# EAGLE design Final Board (EAGLE 7.2.0)
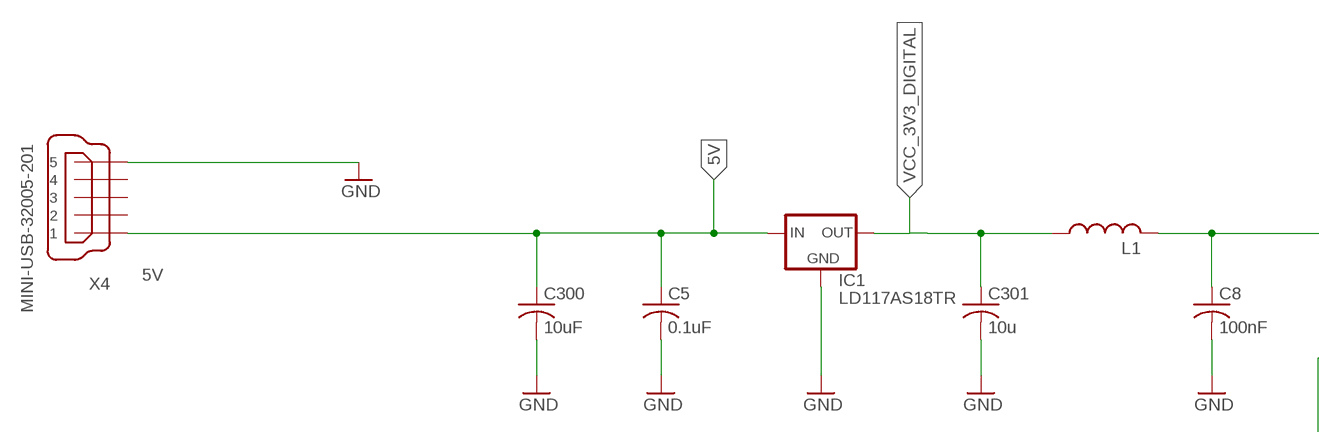
[diagram p0: schematic, sheet 1, part 1 of 2]
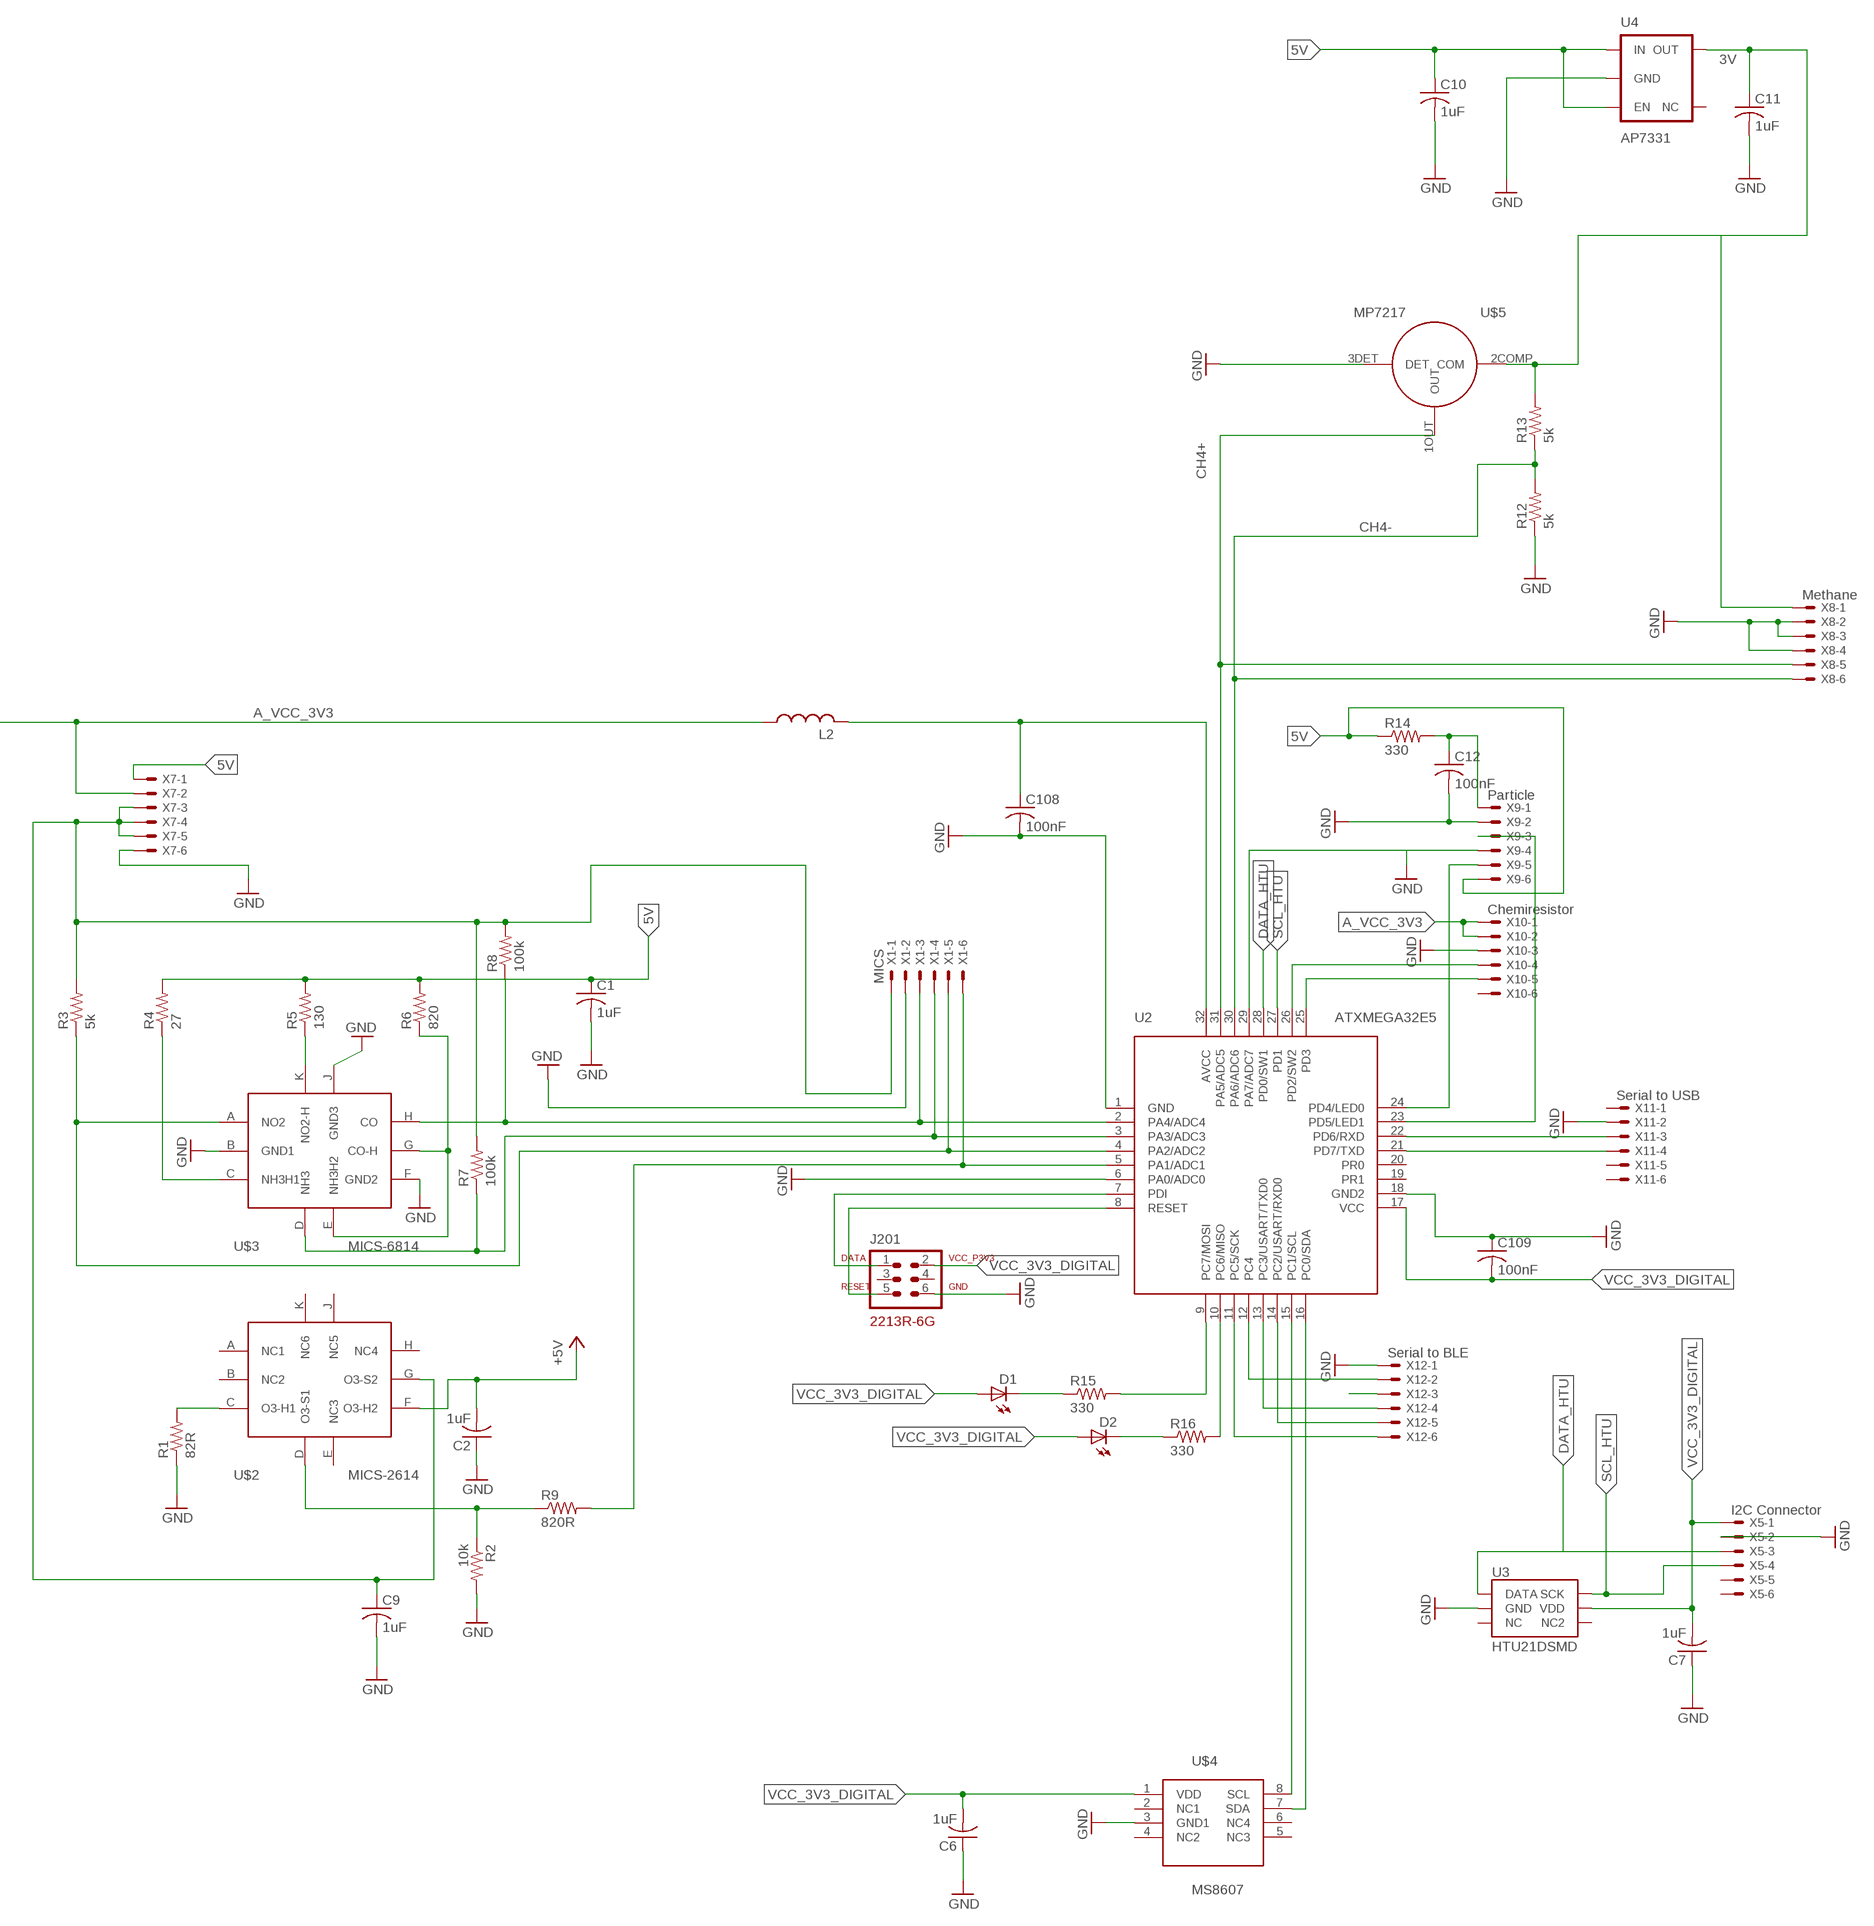
[diagram p1: schematic, sheet 1, part 2 of 2]

## Parts
C1  1uF  C-USC0805  [C0805]
C2  1uF  C-USC0805  [C0805]
C5  0.1uF  C-USC0603  [C0603]
C6  1uF  C-USC0805  [C0805]
C7  1uF  C-USC0805  [C0805]
C8  100nF  C-USC0402  [C0402]
C9  1uF  C-USC0805  [C0805]
C10  1uF  C-USC0805  [C0805]
C11  1uF  C-USC0805  [C0805]
C12  100nF  C-USC0402  [C0402]
C108  100nF  C-USC0402  [C0402]
C109  100nF  C-USC0402  [C0402]
C300  10uF  C-USC1206  [C1206]
C301  10u  C-USC1206  [C1206]
D1  LEDSML0805  [SML0805]
D2  LEDSML0805  [SML0805]
IC1  LD117AS18TR  [SOT223]
J201  PDI  AVR-ISP-6  [AVR-ISP-6]
L1  0603INDUCTOR  [R0603]
L2  0603INDUCTOR  [R0603]
R1  82R  R-US_R0805  [R0805]
R2  10k  R-US_R0805  [R0805]
R3  5k  R-US_R0805  [R0805]
R4  27  R-US_R0805  [R0805]
R5  130  R-US_R0805  [R0805]
R6  820  R-US_R0805  [R0805]
R7  100k  R-US_R0805  [R0805]
R8  100k  R-US_R0805  [R0805]
R9  820R  R-US_R0805  [R0805]
R12  5k  R-US_R0805  [R0805]
R13  5k  R-US_R0805  [R0805]
R14  330  R-US_R0402  [R0402]
R15  330  R-US_R0402  [R0402]
R16  330  R-US_R0402  [R0402]
U2  ATMEGA328P_TQFP  ATXMEGA32E5  [ATXMEGA32E5]
U3  HTU21DSMD  [HTU21D]
U4  AP2202-ADJ  AP7331  [AP7331]
U$2  MICS-2614-SMD8  [MICS-2614-SMD8]
U$3  MICS-6814-SMD8  [MICS-6814-SMD8]
U$4  PTH  [PTHSENSOR]
U$5  MP-7217  [MP-7217]
X1  MICS  22-23-2061  [22-23-2061]
X4  MINI-USB-32005-201  [32005-201]
X5  I2C Connector  22-23-2061  [22-23-2061]
X7  22-23-2061  [22-23-2061]
X8  Methane  22-23-2061  [22-23-2061]
X9  Particle  22-23-2061  [22-23-2061]
X10  Chemiresistor  22-23-2061  [22-23-2061]
X11  Serial to USB  22-23-2061  [22-23-2061]
X12  Serial to BLE  22-23-2061  [22-23-2061]

## Nets
3V: C11.1 R13.2 U4.5(OUT) U$5.2COMP(COM) X8.1
5V: C1.1 C2.2 C5.1 C10.1 C300.1 IC1.3(IN) R4.2 R5.2 R6.2 R9.2 R14.1 U2.5(PA1/ADC1) U4.1(IN) U4.3(EN) U$2.F(O3-H2) X1.6 X4.1 X7.1 X9.6 ; supply symbol labelled +5V
A_VCC_3V3: C8.1 L1.2 L2.1 X7.2 X10.1 X10.2
CH4+: U2.31(PA5/ADC5) U$5.1OUT(OUT) X8.5
CH4-: R12.2 R13.1 U2.30(PA6/ADC6) X8.6
DATA_HTU: U2.28(PD0/SW1) U3.DATA X5.3
GND: C1.2 C2.1 C5.2 C6.1 C7.1 C8.2 C9.2 C10.2 C11.2 C12.2 C108.2 C109.1 C300.2 C301.2 IC1.1(GND) J201.6(GND) R1.1 R2.2 R12.1 U2.1(GND) U2.6(PA0/ADC0) U2.18(GND2) U2.29(PA7/ADC7) U3.GND U4.2(GND) U$3.B(GND1) U$3.F(GND2) U$3.J(GND3) U$4.3(GND1) U$5.3DET(DET) X1.2 X4.5 X5.2 X7.6 X8.2 X8.3 X8.4 X9.2 X9.4 X10.3 X11.2 X12.1
IC1: R3.1 U2.4(PA2/ADC2) U$3.A(NO2) X1.5
N$1: R1.2 U$2.C(O3-H1)
N$2: J201.1(DATA) U2.7(PDI)
N$3: J201.5(RESET) U2.8(RESET)
N$4: R16.2 U2.10(PC6/MISO)
N$5: U2.25(PD3) X10.5
N$6: U2.22(PD6/RXD) X11.3
N$7: R7.1 U2.3(PA3/ADC3) U$3.D(NH3) X1.4
N$8: R6.1 U$3.E(NH3H2) U$3.G(CO-H)
N$9: R5.1 U$3.K(NO2-H)
N$10: R4.1 U$3.C(NH3H1)
N$12: R8.1 U2.2(PA4/ADC4) U$3.H(CO) X1.3
N$13: C108.1 L2.2 U2.32(AVCC)
N$14: U2.26(PD2/SW2) X10.4
N$15: U2.24(PD4/LED0) X9.5
N$16: U2.23(PD5/LED1) X9.3
N$17: U2.16(PC0/SDA) U$4.7(SDA)
N$18: U2.15(PC1/SCL) U$4.8(SCL)
N$19: U2.13(PC3/USART/TXD0) X12.4
N$20: U2.14(PC2/USART/RXD0) X12.5
N$21: R2.1 R9.1 U$2.D(O3-S1)
N$22: C12.1 R14.2 X9.1
N$23: C9.1 R3.2 R7.2 R8.2 U$2.G(O3-S2) X1.1 X7.3 X7.4 X7.5
N$24: U2.21(PD7/TXD) X11.4
N$26: D1.C R15.1
N$27: U2.12(PC4) X12.2
N$28: D2.C R16.1
N$29: R15.2 U2.9(PC7/MOSI)
N$31: U2.11(PC5/SCK) X12.6
N$32: X12.3
SCL_HTU: U2.27(PD1) U3.SCK X5.4
VCC_3V3_DIGITAL: C6.2 C7.2 C109.2 C301.1 D1.A D2.A IC1.2(OUT) J201.2(VCC_P3V3) L1.1 U2.17(VCC) U3.VDD U$4.1(VDD) X5.1
Unconnected: J201.3(NC1) J201.4(NC2) U2.19(PR1) U2.20(PR0) U3.NC@6(NC2) U4.4(NC) U$2.A(NC1) U$2.B(NC2) U$2.E(NC3) U$2.H(NC4) U$2.J(NC5) U$2.K(NC6) U$4.2(NC1) U$4.4(NC2) U$4.5(NC3) U$4.6(NC4) X4.2 X4.3 X4.4 X5.5 X5.6 X10.6 X11.1 X11.5 X11.6

## Power pins joined to a net without a drawn wire
NC: U3.NC@1(NC)

## Library data of the parts
C1 C2 C5-C12 C108 C109 C300 C301 = resistor:C-US: CAPACITOR, American symbol
D1 D2 = led:LED: LED OSRAM: - CHIPLED LG R971, LG N971, LY N971, LG Q971, LY Q971, LO R971, LY R971 LH N974, LH R974 LS Q976, LO Q976, LY Q976 LO Q996 - Hyper CHIPLED LW Q18S LB Q993, LB Q99A, LB R99A - SideLED LS A670, LO A670, LY A670, LG A670, LP A670 LB A673, LV A673, LT A673, LW A673 LH A674 LY A675 LS A676, LA A676, LO A676, LY A676, LW A676 LS A679, LY A679, LG A679 - Hyper Micro SIDELED® LS Y876, LA Y876, LO Y876, LY Y876 LT Y87S - SmartLED LW L88C, LW L88S LB L89C, LB L89S, LG L890 LS L89K, LO L89K, LY L89K LS L896, LA L896, LO L896, LY L896 - TOPLED LS T670, LO T670, LY T670, LG T670, LP T670 LSG T670, LSP T670, LSY T670, LOP T670, LYG T670 LG T671, LOG T671, LSG T671 LB T673, LV T673, LT T673, LW T673 LH T674 LS T676, LA T676, LO T676, LY T676, LB T676, LH T676, LSB T676, LW T676 LB T67C, LV T67C, LT T67C, LS T67K, LO T67K, LY T67K, LW E67C LS E67B, LA E67B, LO E67B, LY E67B, LB E67C, LV E67C, LT E67C LW T67C LS T679, LY T679, LG T679 LS T770, LO T770, LY T770, LG T770, LP T770 LB T773, LV T773, LT T773, LW T773 LH T774 LS E675, LA E675, LY E675, LS T675 LS T776, LA T776, LO T776, LY T776, LB T776 LHGB T686 LT T68C, LB T68C - Hyper Mini TOPLED® LB M676 - Mini TOPLED Santana® LG M470 LS M47K, LO M47K, LY M47K Source: http://www.osram.convergy.de LUXEON: - LUMILED® LXK2-PW12-R00, LXK2-PW12-S00, LXK2-PW14-U00, LXK2-PW14-V00 LXK2-PM12-R00, LXK2-PM12-S00, LXK2-PM14-U00 LXK2-PE12-Q00, LXK2-PE12-R00, LXK2-PE12-S00, LXK2-PE14-T00, LXK2-PE14-U00 LXK2-PB12-K00, LXK2-PB12-L00, LXK2-PB12-M00, LXK2-PB14-N00, LXK2-PB14-P00, LXK2-PB14-Q00 LXK2-PR12-L00, LXK2-PR12-M00, LXK2-PR14-Q00, LXK2-PR14-R00 LXK2-PD12-Q00, LXK2-PD12-R00, LXK2-PD12-S00 LXK2-PH12-R00, LXK2-PH12-S00 LXK2-PL12-P00, LXK2-PL12-Q00, LXK2-PL12-R00 Source: www.luxeon.com KINGBRIGHT: KA-3528ASYC Source: www.kingbright.com
IC1 = Modified NCP1117LP:LD117A?*: Low drop fixed and adjustable positive voltage regulators 1 A Source: http://www.st.com/stonline/products/literature/ds/7194/ld1117axx.pdf
J201 = PDI Interface:AVR-ISP-6: PDI Interface for XMEGA
L1 L2 = 0603 Inductor:0603INDUCTOR: INDUCTOR, American symbol
R1-R9 R12-R16 = resistor:R-US_: RESISTOR, American symbol
U2 = ATXMEGA 32E5:ATXMEGA32E5: Microcontroller by Atmel; PROD_ID: IC-09069
U3 = SparkFun-Sensors:HTU21D; PROD_ID: IC-11793
U4 = AP7331:AP7331: 3V Voltage Regulator from Diodes, Inc.; PROD_ID: VREG-12189
U$2 = MICS2614:MICS-2614-SMD8: MICS-6814, NO2, NH3, CO
U$3 = MICS6814:MICS-6814-SMD8: MICS-6814, NO2, NH3, CO
U$4 = MS8607:PTH: PTH Sensor from Measurement Specialties
U$5 = MP-7217:MP-7217: Methane Sensor (Pellistor)
X1 X5 X7-X12 = con-molex:22-23-2061: .100" (2.54mm) Center Header - 6 Pin; MF: MOLEX; MPN: 22-23-2061; OC_FARNELL: 1462922; OC_NEWARK: 27C1933
X4 = con-cypressindustries:MINI-USB-: MINI USB-B Conector Source: www.cypressindustries.com; OC_FARNELL: unknown; OC_NEWARK: unknown

## Board
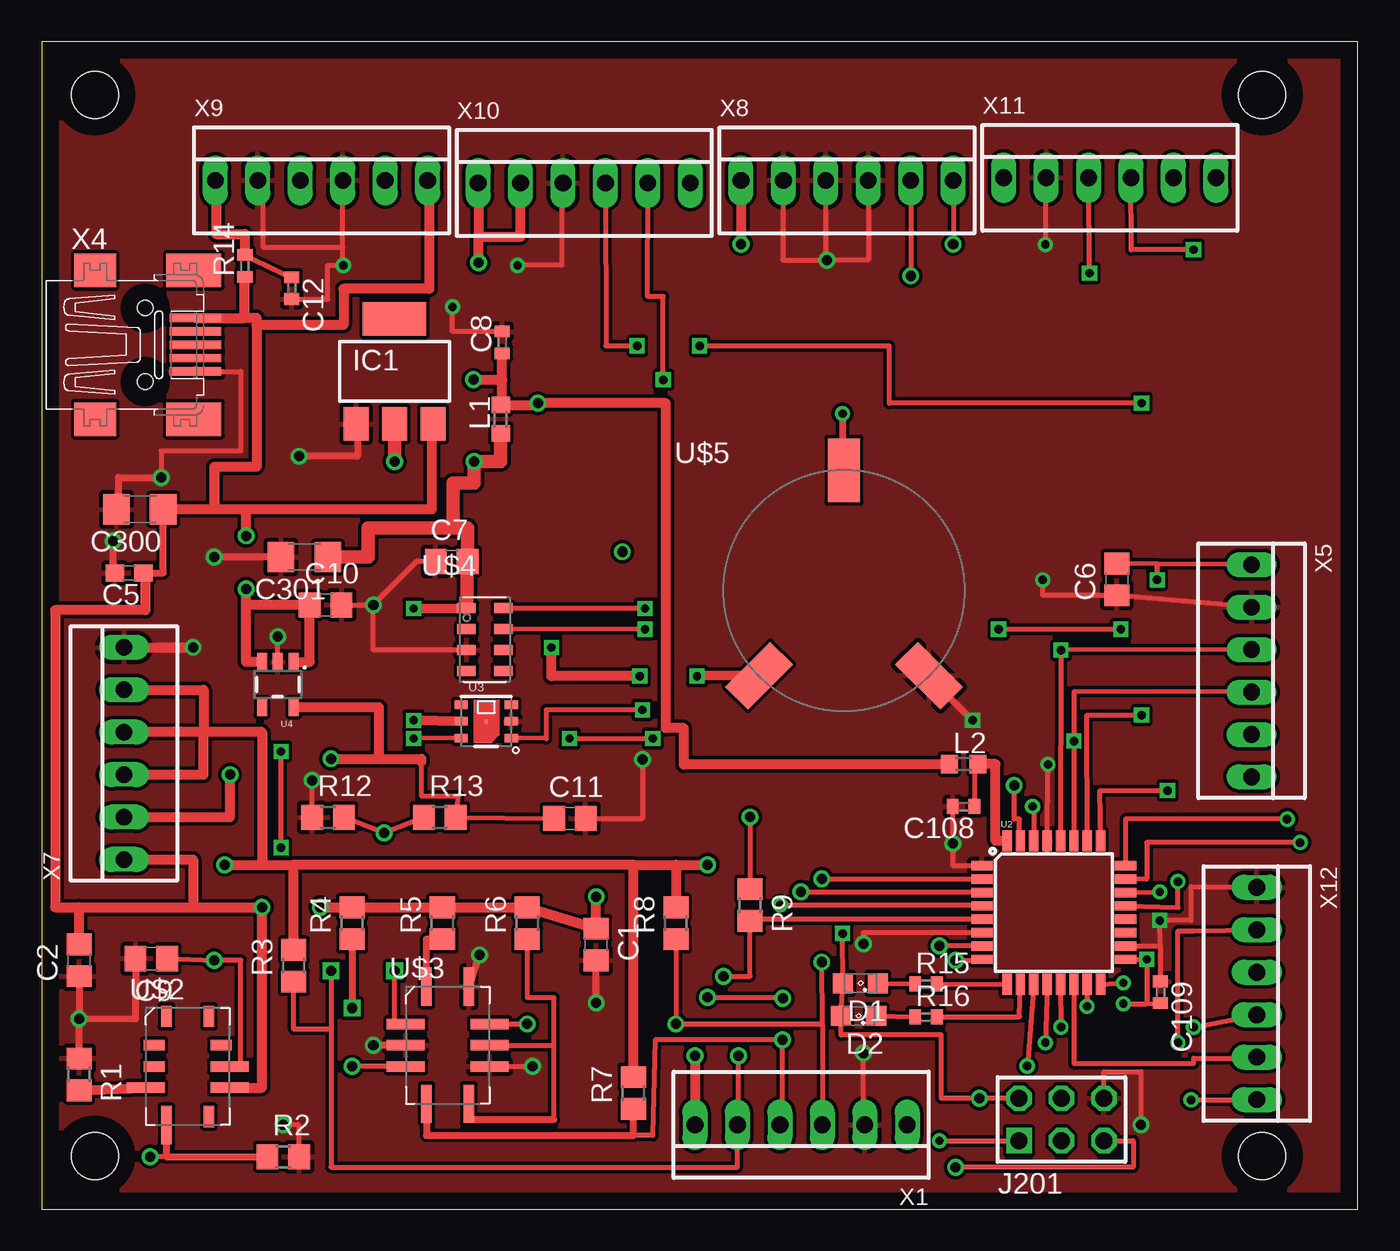
[diagram p2: board, top side]
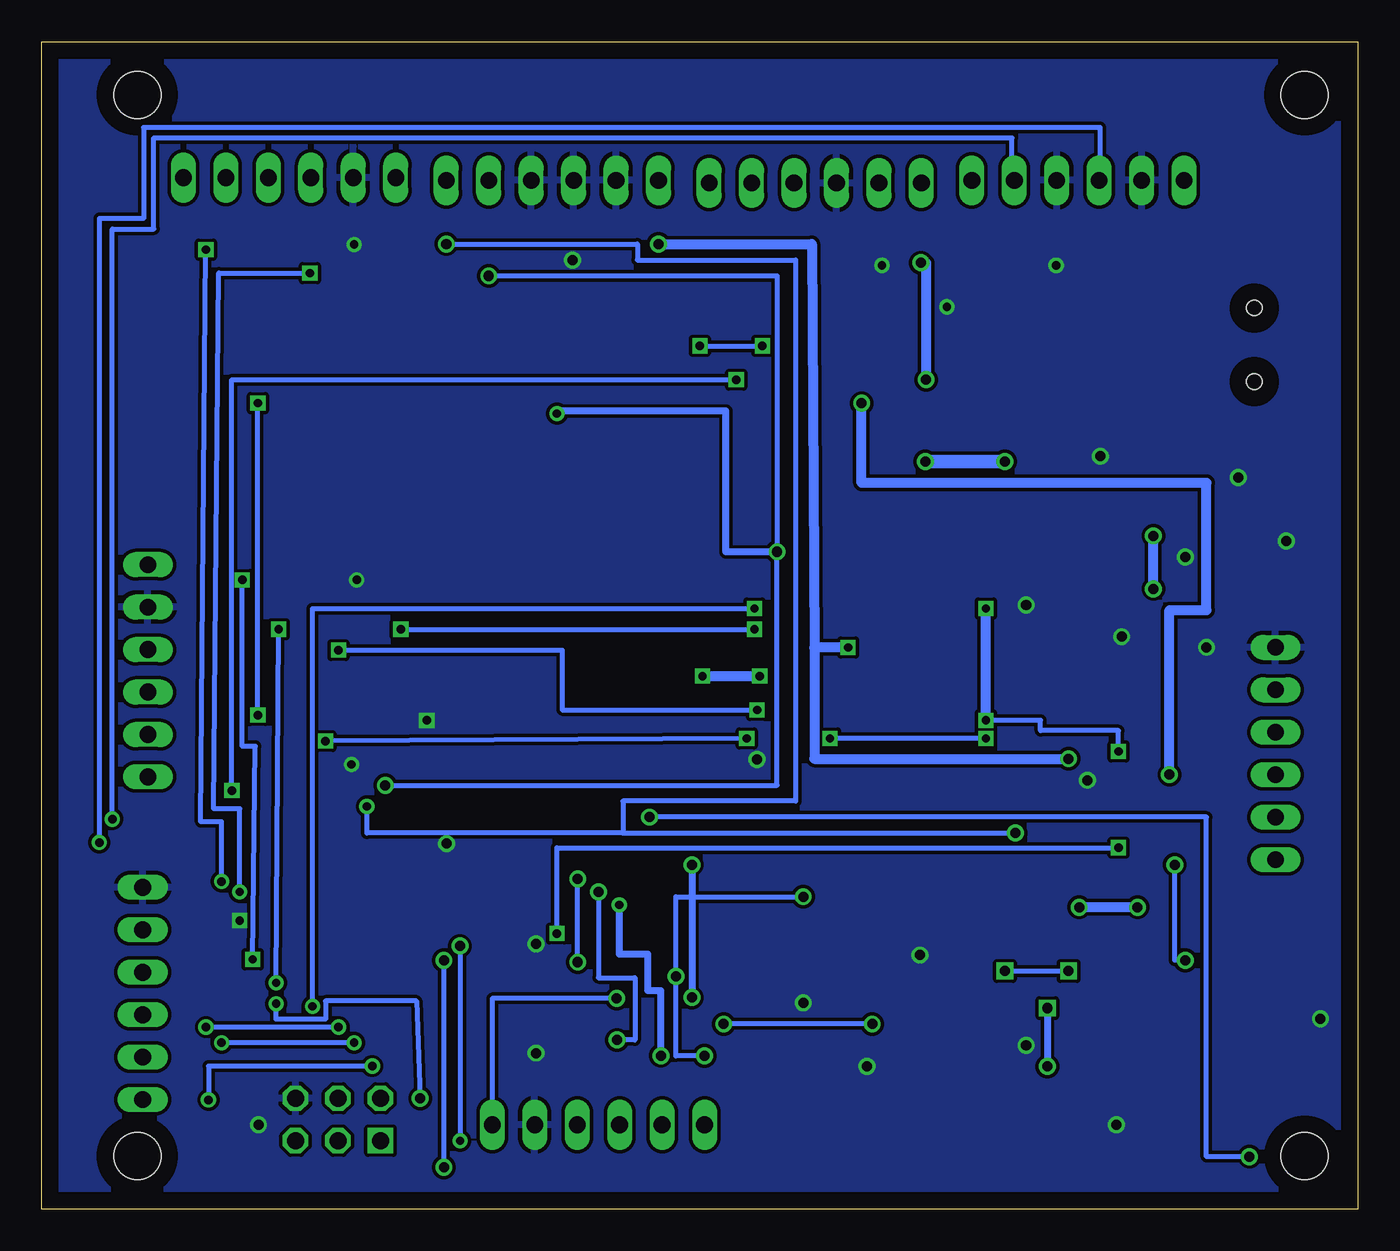
[diagram p3: board, bottom side, seen from below]

Size 78.74 x 69.85 mm. Coordinates in mm from the lower left corner, seen from the top.
Outline: 0,0 78.74,0 78.74,69.85 0,69.85 0,0
Copper layers (1*16): Top 0.035mm / dielectric 1.5mm / Bottom 0.035mm
Design rules "default": minimum track width 10mil, minimum drill 24mil, track to track 8mil, track to pad 8mil, pad to pad 8mil, via to via 8mil, smd to smd 8mil, copper to edge 40mil, drill to drill 8mil, minimum pad ring 10mil, minimum via ring 8mil, stop-mask expansion 4mil, vias tented up to drill 0mil, thermal gap 10mil
Holes 2.8 mm at 3.17,3.17 3.17,66.67 73.03,3.17 73.03,66.67

### Footprints (pad centres in the part's own frame; a part is rotated, then mirrored left to right if it is on the bottom)
C0805 = smd 1.3 x 1.5: 1 -0.95,0; 2 0.95,0
C0603 = smd 1.1 x 1: 1 -0.85,0; 2 0.85,0
C0402 = smd 0.7 x 0.9: 1 -0.65,0; 2 0.65,0
C1206 = smd 1.6 x 1.8: 1 -1.4,0; 2 1.4,0
SML0805 = smd 1.2 x 1.2: A 1.05,0; C -1.05,0
SOT223 = smd 1.5 x 2: 1 -2.3,-3.15; 2 0,-3.15; 3 2.3,-3.15 | smd 3.8 x 2: 4 0,3.15
AVR-ISP-6 = drill 1.016 square: 1 -2.54,-1.27 | drill 1.016 octagon: 2 -2.54,1.27; 3 0,-1.27; 4 0,1.27; 5 2.54,-1.27; 6 2.54,1.27
R0603 = smd 1 x 1.1: 1 -0.85,0; 2 0.85,0
R0805 = smd 1.3 x 1.5: 1 -0.95,0; 2 0.95,0
R0402 = smd 0.7 x 0.9: 1 -0.65,0; 2 0.65,0
ATXMEGA32E5 = smd 1.27 x 0.559: 1 -4.293,2.8; 2 -4.293,2; 3 -4.293,1.2; 4 -4.293,0.4; 5 -4.293,-0.4; 6 -4.293,-1.2; 7 -4.293,-2; 8 -4.293,-2.8; 17 4.293,-2.8; 18 4.293,-2; 19 4.293,-1.2; 20 4.293,-0.4; 21 4.293,0.4; 22 4.293,1.2; 23 4.293,2; 24 4.293,2.8 | smd 0.559 x 1.27: 9 -2.8,-4.293; 10 -2,-4.293; 11 -1.2,-4.293; 12 -0.4,-4.293; 13 0.4,-4.293; 14 1.2,-4.293; 15 2,-4.293; 16 2.8,-4.293; 25 2.8,4.293; 26 2,4.293; 27 1.2,4.293; 28 0.4,4.293; 29 -0.4,4.293; 30 -1.2,4.293; 31 -2,4.293; 32 -2.8,4.293
HTU21D = smd 0.2 x 0.2: 7 0,0 | smd 0.8 x 0.5: DATA 1.5,-1; GND 1.5,0; NC@1 -1.5,1; NC@6 1.5,1; SCK -1.5,-1; VDD -1.5,0
AP7331 = smd 1.05 x 0.6: 1 -1.35,0.95; 2 -1.35,0; 3 -1.35,-0.95; 4 1.35,-0.95; 5 1.35,0.95
MICS-2614-SMD8 = smd 1.27 x 0.635: A -2,1.27; B -2,0; H 2,1.27 | smd 2.286 x 0.635: C -2.508,-1.27; F 2.508,-1.27; G 2.508,0 | smd 0.635 x 2.286: D -1.27,-3.508 | smd 0.635 x 1.27: E 1.27,-3; J 1.27,3; K -1.27,3
MICS-6814-SMD8 = smd 2.286 x 0.635: A -2.508,1.27; B -2.508,0; C -2.508,-1.27; F 2.508,-1.27; G 2.508,0; H 2.508,1.27 | smd 0.635 x 2.286: D -1.27,-3.508; E 1.27,-3.508; J 1.27,3.508; K -1.27,3.508
PTHSENSOR = smd 1.1 x 0.6: 1 -1.1,1.875; 2 -1.1,0.625; 3 -1.1,-0.625; 4 -1.1,-1.875; 5 1.1,-1.875; 6 1.1,-0.625; 7 1.1,0.625; 8 1.1,1.875
MP-7217 = smd 1.93 x 3.81: 1OUT 0,7.2 | smd 3.81 x 1.93 rotated 45: 2COMP -5.09,-5.09 | smd 3.81 x 1.93 rotated 135: 3DET 5.09,-5.09
22-23-2061 = drill 1 long: 1 -6.35,0; 2 -3.81,0; 3 -1.27,0; 4 1.27,0; 5 3.81,0; 6 6.35,0
32005-201 = smd 3.1 x 0.5: 1 3,1.6; 2 3,0.8; 3 3,0; 4 3,-0.8; 5 3,-1.6 | smd 2.5 x 2: M1 -3,-4.45; M2 -3,4.45 | smd 3.3 x 2: M3 2.9,4.45; M4 2.9,-4.45 | hole 0.9: 0,2.2; 0,-2.2

### Placement (x,y rotation side)
C1  33.18,15.84 270 top
C2  2.23,14.88 90 top
C5  5.24,38.06 180 top
C6  64.32,37.67 90 top
C7  24.52,38.75 0 top
C8  27.55,51.86 90 top
C9  6.56,14.99 180 top
C10  16.98,36.16 0 top
C11  31.6,23.38 0 top
C12  14.95,55.1 270 top
C108  55.16,24.09 180 top
C109  66.93,12.98 270 top
C300  5.87,41.87 180 top
C301  15.71,39.01 180 top
D1  48.98,13.51 180 top
D2  48.88,11.55 180 top
IC1  21.11,50.13 0 top
J201  61.02,5.36 0 top
L1  27.46,47.27 90 top
L2  55.16,26.63 0 top
R1  2.23,8.06 270 top
R2  14.44,3.14 0 top
R3  15.08,14.57 90 top
R4  18.57,17.11 90 top
R5  23.97,17.11 90 top
R6  29.05,17.11 90 top
R7  35.4,6.95 90 top
R8  37.94,17.11 90 top
R9  42.38,18.2 270 top
R12  17.13,23.44 0 top
R13  23.81,23.44 0 top
R14  12.15,56.44 90 top
R15  52.91,13.47 0 top
R16  52.91,11.5 0 top
U2  60.56,17.74 0 top
U3  26.59,29.19 0 top
U4  14.13,31.39 270 top
U$2  8.73,8.53 0 top
U$3  24.29,9.8 0 top
U$4  26.51,34.08 0 top
U$5  48,37.01 0 top
X1  45.43,5.04 180 top
X4  6.19,51.72 0 top
X5  72.39,32.21 270 top
X7  4.92,27.27 90 top
X8  48.18,61.56 0 top
X9  16.74,61.56 0 top
X10  32.46,61.4 0 top
X11  63.91,61.71 0 top
X12  72.7,12.9 270 top

### Tracks (layer width: path | path; a pad name or v marks a point on that pad's centre or on a via)
3V  (via drill 0.5, 0.6)
  Top 0.305: 22.7,26.94 22.7,26.76 22.7,24.73 24.92,24.73 R13.2 C11.1
  Top 0.61: U4.5 20.16,30.04 20.16,26.95 | X8.1 v41.83,57.75 | v17.3,26.95 20.16,26.95 | U$5.2COMP v39.2,31.89 | v35.78,31.89 30.49,31.89 v30.49,33.6 | 20.16,26.95 22.7,26.95 22.7,26.76
  Bottom 0.61: v41.83,57.75 32.66,57.75 32.51,33.6 | 32.51,33.6 32.51,26.95 v17.3,26.95 | v39.2,31.89 arc-1 v35.78,31.89 | v30.49,33.6 32.51,33.6
5V  (via drill 0.6)
  Top 0.305: v40.8,13.93 42.38,13.93 R9.2 42.38,17.34 U2.5
  Top 0.406: C300.1 7.27,38.06 C5.1 5.87,38.06 | IC1.3 23.33,46.98
  Top 0.61: C2.2 2.23,18.06 | 2.23,18.06 0.79,18.06 0.79,35.84 6.19,35.84 6.19,38.06 5.87,38.06 | 23.33,46.98 23.33,41.87 12.22,41.87 | 12.22,41.87 10.32,41.87 | 10.32,41.87 C300.1 | 2.23,18.06 9.04,18.06 | 9.04,18.06 v13.17,18.06 13.17,7.26 U$2.F | X7.1 9.04,20.92 9.04,18.06 | v16.67,18.06 R4.2 R5.2 R6.2 C1.1 v33.18,18.69 | v39.08,9.17 X1.6 | 10.32,41.87 10.32,44.41 12.86,44.41 12.86,52.9 | 12.22,36.16 C10.1 16.03,32.74 U4.1 | 12.22,36.16 v12.22,37.11 | v12.22,40.28 12.22,41.87 | U4.3 12.22,32.74 12.22,36.16 | X4.1 12.15,53.32 | 12.86,52.9 12.86,53.32 12.15,53.32 | 12.15,53.32 R14.1 | X9.6 23.18,62.02 23.18,55.07 18.05,55.07 18.05,52.9 12.86,52.9
  Bottom 0.305: v33.18,18.69 40.8,18.69 v40.8,13.93 40.8,9.17 v39.08,9.17
  Bottom 0.61: v13.17,18.06 v16.67,18.06 | v12.22,37.11 v12.22,40.28
A_VCC_3V3  (via drill 0.6)
  Top 0.61: X7.2 11.27,23.46 v11.27,26 | X10.1 26.14,62.02 26.14,58.19 | 26.14,58.19 28.65,58.19 X10.2 | v26.14,56.63 26.14,58.19 | 27.55,49.63 27.55,48.12 L1.2 29.68,48.12 v29.68,48.22 37.34,48.22 37.34,28.78 38.43,28.78 38.43,26.6 54.31,26.6 L2.1 | 27.55,49.63 C8.1 | v25.82,49.63 27.55,49.63
  Bottom 0.61: v11.27,26 11.27,35.84 9.05,35.84 9.05,43.46 29.68,43.46 v29.68,48.22 | v26.14,56.63 25.82,56.63 v25.82,49.63
CH4+  (via drill 0.5, 0.6)
  Top 0.305: X8.5 v51.99,55.84 | U2.31 58.5,22.04 58.5,23.34 58.19,23.34 v58.19,25.36
  Top 0.406: 47.92,43.36 U$5.1OUT 47.92,44.29 v47.92,47.61
  Bottom 0.305: v51.99,55.84 34.74,55.84 v34.74,39.33 34.74,25.36 v58.19,25.36
  Bottom 0.406: v34.74,39.33 37.8,39.33 37.8,47.76 47.76,47.76 v47.92,47.61
CH4-  (via drill 0.5, 0.6)
  Top 0.305: R13.1 v20.48,22.5 R12.2 | X8.6 v54.53,57.75 | v59.29,24.09 59.36,24.09 U2.30
  Bottom 0.305: v54.53,57.75 43.1,57.75 43.1,56.79 33.63,56.79 33.63,24.41 43.97,24.41 43.97,22.5 | 43.97,22.5 v20.48,22.5 | 43.97,22.5 59.29,22.5 v59.29,24.09
DATA_HTU  (via drill 0.5)
  Top 0.305: X5.3 v60.98,33.45 U2.28 | v35.94,29.87 30.18,29.87 30.18,28.16 U3.DATA
  Bottom 0.305: v60.98,33.45 47.61,33.45 47.61,29.87 v35.94,29.87
GND  (via drill 0.5, 0.6)
  Top 0.305: U$3.F v29.37,8.53 | R2.2 15.4,5.04 v14.44,5.04 | U2.1 54.52,20.54 v54.52,21.87 v54.51,21.87 C108.2 | J201.6 63.56,8.22 65.77,8.22 v65.77,5.04 | U2.18 66.93,15.74 | 66.93,15.74 C109.1 | X4.5 11.9,50.12 11.9,45.36 7.14,45.36 v7.14,43.78 | C10.2 v19.84,36.16 | U4.2 v14.13,34.25 | X8.2 44.34,61.56 44.34,56.78 v46.98,56.78 | v46.98,56.78 46.91,56.78 X8.3 | X8.4 49.45,56.78 v46.98,56.78 | C11.2 35.94,23.38 v35.94,26.91 35.94,26.94 | U2.6 49.16,16.54 v49.16,15.87 | C8.2 24.58,52.51 v24.58,53.98 | X10.3 31.11,62.02 31.11,56.47 v28.47,56.47 | C12.2 17.11,54.45 17.11,56.47 v18.05,56.47 | 18.05,56.63 18.01,56.63 18.01,57.56 | 18.01,57.56 X9.4 | X9.2 13.22,62.02 13.22,57.56 18.01,57.56 | X11.2 60.05,61.71 v60.05,57.72 | X1.2 49.16,5.04 v49.16,9.34 | C7.1 22.43,38.75 v19.84,36.16 | U$4.3 19.84,33.46 v19.84,36.16 | 66.93,15.74 v66.9,17.27 68.76,17.27 68.76,19.29 X12.1 | R12.1 v16.18,25.66 | U2.29 v60.21,26.6 | X5.2 C6.1 59.9,36.72 v59.9,37.65
  Top 0.406: R1.1 v2.23,11.39 | C2.1 v2.23,11.39 | v33.18,12.34 C1.2 | U$3.J v26.19,15.2 | U$3.B v19.84,9.8 | C300.2 4.6,42.19 4.6,43.78 v7.14,43.78 | C5.2 4.28,38.38 v4.28,39.97 | IC1.1 18.89,46.98 18.89,45.05 v15.4,45.05 | C301.2 v10.32,39.01 | C9.2 5.6,11.36 v2.23,11.39 | U$5.3DET 53.09,31.85 v55.7,29.25
  Top 0.61: X7.6 v9.05,33.62
  pour Top: 78.1,0.16 0.31,0.31 0.31,69.54 78.25,69.54
  pour Bottom: 0.31,69.54 78.25,69.54 78.25,69.39 78.1,69.39 78.1,0.47 0.31,0.47
IC1  (via drill 0.5, 0.6)
  Top 0.305: 17.3,10.76 17.3,2.5 41.62,2.5 X1.5 41.69,5.04 v41.69,9.18 | 21.11,11.07 v21.11,14.25 | v17.3,14.25 17.3,10.76 | 17.3,10.76 15.08,10.76 R3.1 | v44.18,18.2 56.26,18.2 U2.4
  Top 0.406: U$3.A 21.11,11.07
  Bottom 0.305: v21.11,14.25 v17.3,14.25
  Bottom 0.406: v41.69,9.18 41.69,13.07 42.47,13.07 42.47,15.25 44.18,15.25 v44.18,18.2
N$1
  Top 0.61: R1.2 U$2.C
N$2  (via drill 0.5, 0.6)
  Top 0.305: U2.7 v53.72,15.74 | v53.72,4.09 J201.1
  Bottom 0.305: v53.72,15.74 v53.72,4.09
N$3  (via drill 0.6)
  Top 0.305: J201.5 65.31,4.09 65.31,2.5 v54.68,2.5 | v54.68,14.88 56.26,14.88 U2.8
  Bottom 0.305: v54.68,2.5 v54.68,14.88
N$4
  Top 0.305: R16.2 58.5,11.51 U2.10
N$5  (via drill 0.5)
  Top 0.305: U2.25 63.32,25.05 v67.36,25.05 | v37.18,49.63 37.18,54.61 36.25,54.61 X10.5
  Bottom 0.305: v67.36,25.05 67.36,49.63 v37.18,49.63
N$6  (via drill 0.5)
  Top 0.305: U2.22 v66.9,18.98 | v62.7,56.01 X11.3
  Bottom 0.305: v66.9,18.98 66.9,23.96 68.45,23.96 68.14,56.01 v62.7,56.01
N$7  (via drill 0.6)
  Top 0.305: 35.4,4.41 36.55,4.41 36.71,10.12 v44.32,10.12 44.32,5.04 X1.4 | v45.43,18.98 56.26,18.98 U2.3
  Top 0.406: U$3.D 23.02,4.41 35.4,4.41 R7.1
  Bottom 0.305: v45.43,18.98 45.43,13.85 43.25,13.85 43.25,10.12 v44.32,10.12
N$8
  Top 0.305: R6.1 29.05,12.66 30.64,12.66 30.64,9.8 | 30.64,9.8 30.64,5.36 | U$3.G 30.64,9.8
  Top 0.406: U$3.E 25.56,5.36 30.64,5.36
N$9
  Top 0.406: U$3.K 23.02,16.16 R5.1
N$10  (via drill 0.6)
  Top 0.305: U$3.C v18.57,8.53
  Top 0.406: R4.1 v18.57,12.03
  Bottom 0.406: v18.57,12.03 v18.57,8.53
N$12  (via drill 0.6)
  Top 0.305: R8.1 v37.94,11.07 46.7,11.07 | U$3.H v29.05,11.07 | 46.7,11.07 X1.3 | v46.67,19.76 56.26,19.76 U2.2 | 46.7,11.07 v46.67,14.78
  Bottom 0.305: v29.05,11.07 v37.94,11.07 | v46.67,14.78 v46.67,19.76
N$13
  Top 0.305: L2.2 55.81,26.63 C108.1
  Top 0.61: U2.32 57.06,22.04 57.06,26.63 L2.2
N$14  (via drill 0.5)
  Top 0.305: U2.26 62.54,29.56 v65.81,29.56 | v65.81,48.23 50.72,48.23 50.72,51.65 v39.36,51.65 | v35.63,51.65 33.76,51.65 X10.4
  Bottom 0.305: v65.81,29.56 v65.81,48.23 | v39.36,51.65 v35.63,51.65
N$15  (via drill 0.5)
  Top 0.305: v74.52,23.34 64.85,23.34 U2.24
  Bottom 0.305: X9.5 20.69,62.02 20.69,64.1 72.03,64.1 72.03,58.65 74.52,58.65 v74.52,23.34
N$16  (via drill 0.5)
  Top 0.305: 64.86,19.76 U2.23 66.12,19.76 66.12,21.94 v75.3,21.94
  Bottom 0.305: X9.3 15.4,62.02 15.4,64.72 72.65,64.72 72.65,59.27 75.3,59.27 v75.3,21.94
N$17  (via drill 0.5)
  Top 0.305: U2.16 v64.72,13.54 | v64.56,34.69 v57.25,34.69 | v36.09,34.69 U$4.7
  Bottom 0.305: v64.72,13.54 v64.56,34.69 | v57.25,34.69 v36.09,34.69
N$18  (via drill 0.5)
  Top 0.305: U2.15 62.54,13.45 v62.54,12.13 | v36.09,35.94 27.61,35.94 U$4.8
  Bottom 0.305: v62.54,12.13 62.54,35.94 v36.09,35.94
N$19  (via drill 0.5)
  Top 0.305: U2.13 v60.98,10.89 | v68.92,10.89 X12.4
  Bottom 0.305: v60.98,10.89 v68.92,10.89
N$20
  Top 0.305: U2.14 61.76,8.71 68.92,8.71 68.92,9.02 72.7,9.02 X12.5
N$21  (via drill 0.6)
  Top 0.305: 7.46,3.14 v6.48,3.14 | v42.38,23.46 R9.1
  Top 0.406: U$2.D 7.46,3.14 R2.1
  Bottom 0.305: v6.48,3.14 9.05,3.14 9.05,23.46 v42.38,23.46
N$22
  Top 0.305: R14.2 C12.1
  Top 0.61: X9.1 10.42,62.02 10.42,58.34 12.15,58.34 R14.2
N$23  (via drill 0.6)
  Top 0.305: U$2.G 11.9,8.53 11.9,14.88 v10.32,14.88 C9.1 | v39.84,12.66 44.03,12.66 v44.34,12.6
  Top 0.61: X7.5 9.68,31.08 9.68,28.54 | 9.68,28.54 X7.4 | X7.3 9.68,26 9.68,28.54 | R3.2 15.08,20.6 | 9.68,28.54 13.17,28.54 13.17,20.6 | v10.95,20.6 13.17,20.6 | 13.17,20.6 15.08,20.6 | R8.2 37.94,20.6 | 35.72,7.9 R7.2 35.4,20.6 | 35.4,20.6 37.94,20.6 | 35.4,20.6 15.08,20.6 | 37.94,20.6 v39.84,20.6
  Bottom 0.305: v10.32,14.88 10.95,14.88 v10.95,20.6 | X1.1 51.78,12.6 v44.34,12.6
  Bottom 0.406: v39.84,20.6 v39.84,12.66
N$24  (via drill 0.5)
  Top 0.305: U2.21 67.99,18.05 v67.99,19.6 | v68.92,57.41 65.19,57.41 X11.4
  Bottom 0.305: v67.99,19.6 67.99,23.18 69.23,23.18 v68.92,57.41
N$26
  Top 0.305: D1.C R15.1
N$27  (via drill 0.5)
  Top 0.305: U2.12 v60.05,9.96 | X12.2 68.92,16.65 67.99,16.65 v67.99,9.96
  Bottom 0.305: v60.05,9.96 v67.99,9.96
N$28
  Top 0.305: D2.C R16.1
N$29
  Top 0.305: 57.76,13.46 U2.9 R15.2
N$31  (via drill 0.5)
  Top 0.305: U2.11 v58.96,8.56 | v68.76,6.53 X12.6
  Bottom 0.305: v58.96,8.56 68.76,8.56 v68.76,6.53
SCL_HTU  (via drill 0.5)
  Top 0.305: U3.SCK v22.25,28.16 | v31.58,28.16 v36.56,28.16 | U2.27 v61.76,28 61.76,30.96 X5.4
  Bottom 0.305: v22.25,28.16 v31.58,28.16 | v36.56,28.16 v61.76,28
VCC_3V3_DIGITAL  (via drill 0.5, 0.6)
  Top 0.305: J201.2 v56.1,6.63 53.83,6.63 53.83,10.42 47.83,10.42 D2.A D1.A v47.92,16.49 | U2.17 v66.12,14.94 66.12,12.29 | 66.93,12.29 C109.2 66.12,12.29 | v14.31,21.62 v14.31,27.38 | X5.1 66.74,38.6 | 66.74,38.6 C6.2 | v64.72,12.29 66.12,12.29 | v66.74,37.65 66.74,38.6
  Top 0.61: U3.VDD v22.25,29.25 | v22.25,35.94 U$4.1
  Top 0.813: IC1.2 v21.11,44.73 | L1.1 27.46,44.73 v25.87,44.73 25.87,43.46 24.6,43.46 24.6,40.76 | C301.1 19.52,39.01 19.52,40.76 24.6,40.76 | U$4.1 C7.2 25.47,40.76 24.6,40.76
  Bottom 0.305: v56.1,6.63 56.32,12.45 61.76,12.45 61.76,11.36 64.72,11.36 v64.72,12.29 | v47.92,16.49 47.92,21.62 v14.31,21.62 | v14.31,27.38 14.31,28.63 18.98,28.63 18.98,29.25 v22.25,29.25 | v66.12,14.94 65.96,27.69 66.74,27.69 v66.74,37.65
  Bottom 0.61: v22.25,29.25 v22.25,35.94
  Bottom 0.813: v21.11,44.73 v25.87,44.73